# Altium schematic sheet Sheet2.SchDoc
size A
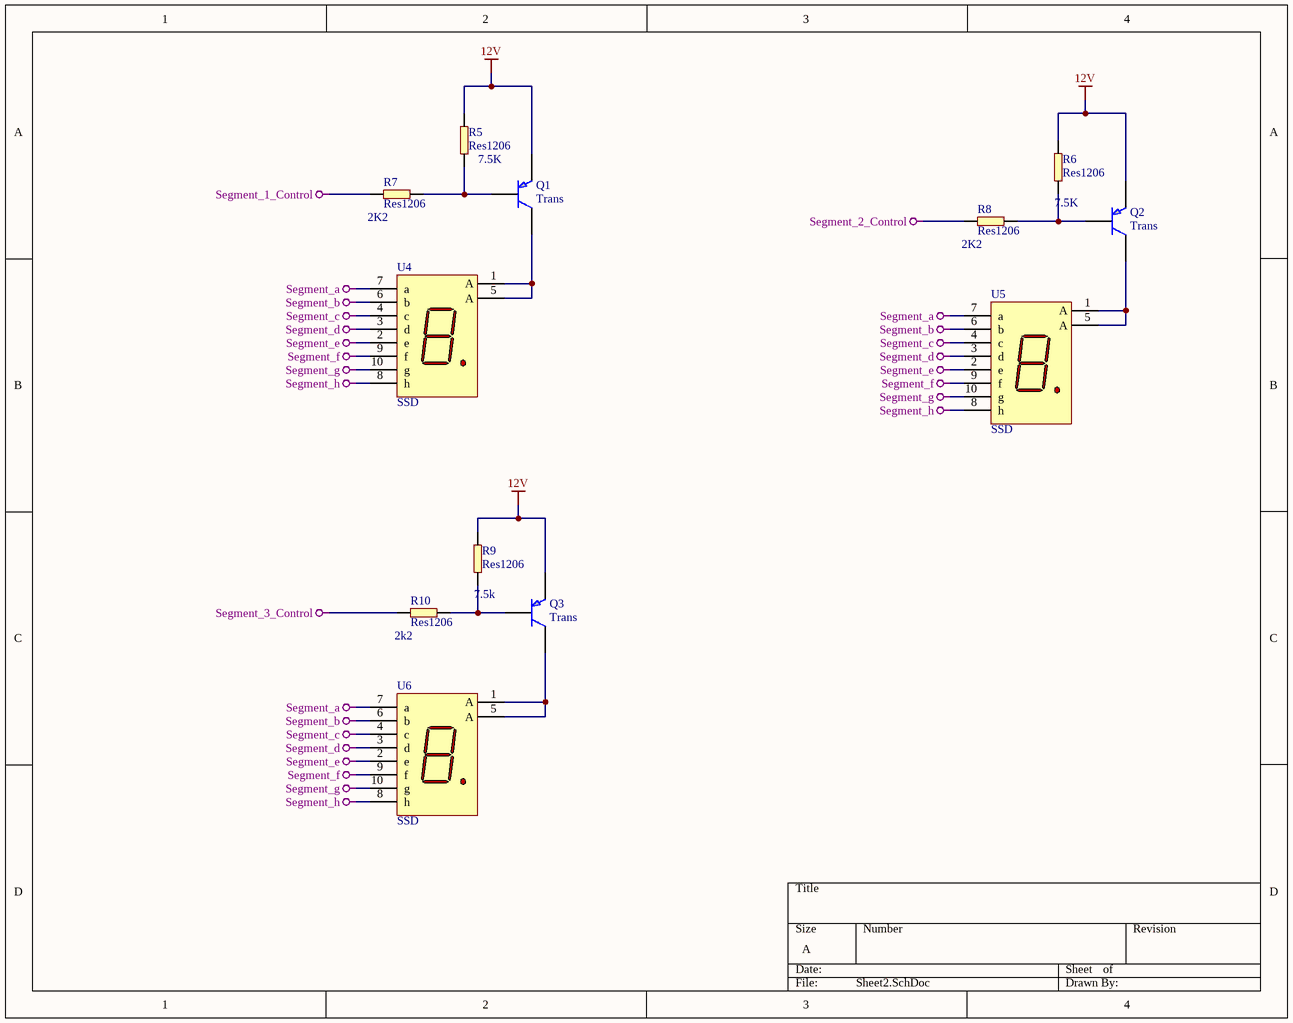
[diagram p0: Sheet2.SchDoc]

## Parts
Q1  Trans  [2N6107]
Q2  Trans  [2N6107]
Q3  Trans  [2N6107]
R5  Res1206  value 7.5K  [1206]
R6  Res1206  value 7.5K  [1206]
R7  Res1206  value 2K2  [1206]
R8  Res1206  value 2K2  [1206]
R9  Res1206  value 7.5k  [1206]
R10  Res1206  value 2k2  [1206]
U4  SSD  [SP1802_SSD]
U5  SSD  [SP1802_SSD]
U6  SSD  [SP1802_SSD]

## Nets
12V: Q1.3(E) Q2.3(E) Q3.3(E) R5.1(a) R6.2(b) R9.2(b)
Segment_1_Control: R7.2(b)
Segment_2_Control: R8.1(a)
Segment_3_Control: R10.1(a)
Segment_a: U4.7(a) U5.7(a) U6.7(a)
Segment_b: U4.6(b) U5.6(b) U6.6(b)
Segment_c: U4.4(c) U5.4(c) U6.4(c)
Segment_d: U4.3(d) U5.3(d) U6.3(d)
Segment_e: U4.2(e) U5.2(e) U6.2(e)
Segment_f: U4.9(f) U5.9(f) U6.9(f)
Segment_g: U4.10(g) U5.10(g) U6.10(g)
Segment_h: U4.8(h) U5.8(h) U6.8(h)
NetQ1_1: Q1.1(B) R5.2(b) R7.1(a)
NetQ1_2: Q1.2(C) U4.1(A) U4.5(A)
NetQ2_1: Q2.1(B) R6.1(a) R8.2(b)
NetQ2_2: Q2.2(C) U5.1(A) U5.5(A)
NetQ3_1: Q3.1(B) R9.1(a) R10.2(b)
NetQ3_2: Q3.2(C) U6.1(A) U6.5(A)

## Library data of the parts
Q1-Q3 = 2N6107: pnp transistor
U4-U6 = SP1802: SSD 48MM